# Altium schematic sheet MGTAVCC.SchDoc
size A4
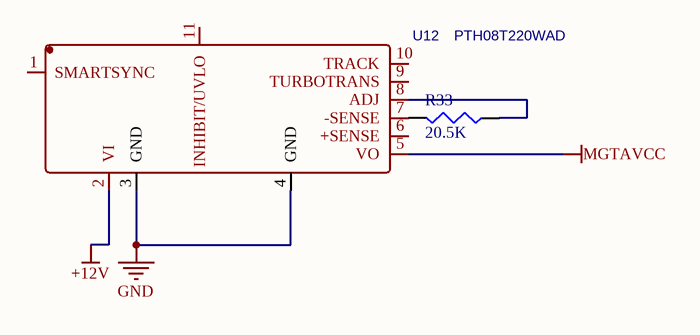
[diagram p0: MGTAVCC.SchDoc]

## Parts
R33  value 20.5K  [J1-0603]  (hidden comment: Res3)
U12  PTH08T220WAD  [PWRM-TH_11P-L23.1-W19.9-P3.17]

## Nets
+12V: U12.2(VI)
GND: U12.3(GND) U12.4(GND)
MGTAVCC: U12.5(VO)
NetR33_1: R33.1 U12.8(ADJ)
NetR33_2: R33.2 U12.7(-SENSE)

Not connected (* = marked no-connect by the designer): U12 1(SMARTSYNC) 6(+SENSE) 9(TURBOTRANS) 10(TRACK) 11(INHIBIT/UVLO)

## Library data of the parts
R33 = Res3: Resistor; Published: 8-Jun-2000; LatestRevisionDate: 29-May-2009; LatestRevisionNote: IPC-7351 Footprint Added.; PackageReference: J1-0603; Publisher: Altium Limited; PackageDescription: Chip Resistor
U12 = PTH08T220WAD: BOM_Manufacturer: Texas Instruments; Contributor: LCSC; BOM_Supplier: LCSC; BOM_Supplier Part: C79289; BOM_Manufacturer Part: PTH08T220WAD; spicePre: U; spiceSymbolName: PTH08T220WAD